# EasyEDA Pro project Keyboard.epro

# Schematic Schematic1
Board Name: Keyboard; Create Date: 2025-11-27; Page Name: KEYBOARD_MAIN; Project Name: esp32PhoneV2-retry; Schematic Name: Schematic1; Update Date: 2025-12-17; Company: EasyEDA.com; Page Size: A4; Version: V1.0
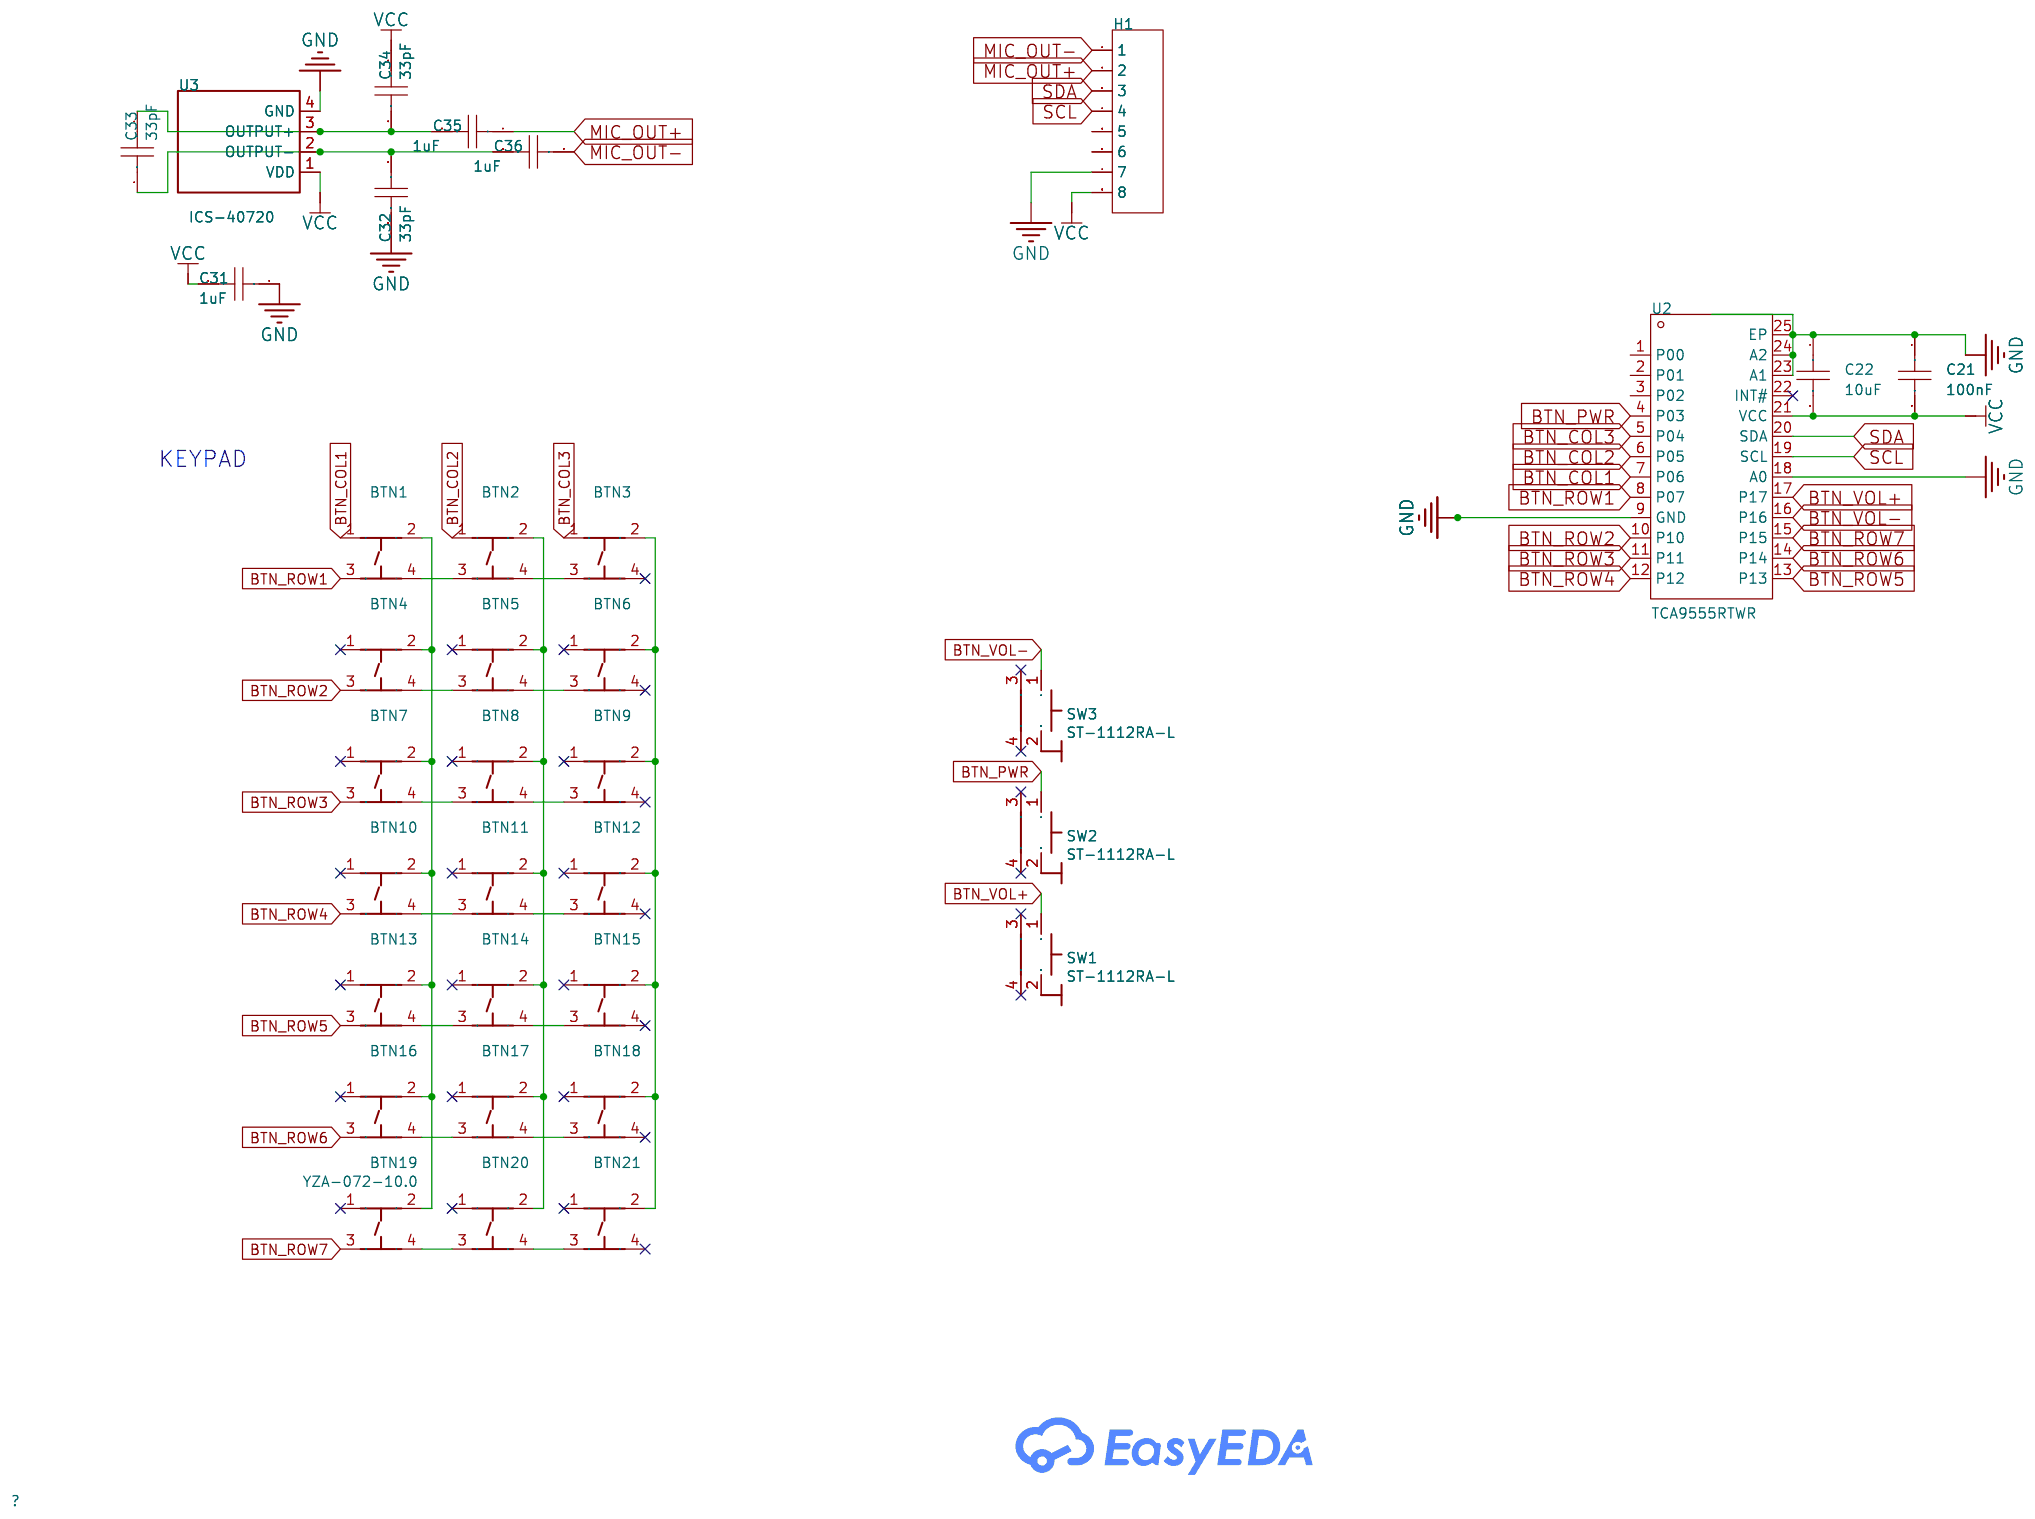
[diagram p0: schematic sheet]

## Parts
BTN1  YZA-072-10.0  [SW-SMD_4P-L6.0-W6.0-P4.5-LS9.0-YZA-072-10.0]
BTN2  YZA-072-10.0  [SW-SMD_4P-L6.0-W6.0-P4.5-LS9.0-YZA-072-10.0]
BTN3  YZA-072-10.0  [SW-SMD_4P-L6.0-W6.0-P4.5-LS9.0-YZA-072-10.0]
BTN4  YZA-072-10.0  [SW-SMD_4P-L6.0-W6.0-P4.5-LS9.0-YZA-072-10.0]
BTN5  YZA-072-10.0  [SW-SMD_4P-L6.0-W6.0-P4.5-LS9.0-YZA-072-10.0]
BTN6  YZA-072-10.0  [SW-SMD_4P-L6.0-W6.0-P4.5-LS9.0-YZA-072-10.0]
BTN7  YZA-072-10.0  [SW-SMD_4P-L6.0-W6.0-P4.5-LS9.0-YZA-072-10.0]
BTN8  YZA-072-10.0  [SW-SMD_4P-L6.0-W6.0-P4.5-LS9.0-YZA-072-10.0]
BTN9  YZA-072-10.0  [SW-SMD_4P-L6.0-W6.0-P4.5-LS9.0-YZA-072-10.0]
BTN10  YZA-072-10.0  [SW-SMD_4P-L6.0-W6.0-P4.5-LS9.0-YZA-072-10.0]
BTN11  YZA-072-10.0  [SW-SMD_4P-L6.0-W6.0-P4.5-LS9.0-YZA-072-10.0]
BTN12  YZA-072-10.0  [SW-SMD_4P-L6.0-W6.0-P4.5-LS9.0-YZA-072-10.0]
BTN13  YZA-072-10.0  [SW-SMD_4P-L6.0-W6.0-P4.5-LS9.0-YZA-072-10.0]
BTN14  YZA-072-10.0  [SW-SMD_4P-L6.0-W6.0-P4.5-LS9.0-YZA-072-10.0]
BTN15  YZA-072-10.0  [SW-SMD_4P-L6.0-W6.0-P4.5-LS9.0-YZA-072-10.0]
BTN16  YZA-072-10.0  [SW-SMD_4P-L6.0-W6.0-P4.5-LS9.0-YZA-072-10.0]
BTN17  YZA-072-10.0  [SW-SMD_4P-L6.0-W6.0-P4.5-LS9.0-YZA-072-10.0]
BTN18  YZA-072-10.0  [SW-SMD_4P-L6.0-W6.0-P4.5-LS9.0-YZA-072-10.0]
BTN19  YZA-072-10.0  [SW-SMD_4P-L6.0-W6.0-P4.5-LS9.0-YZA-072-10.0]
BTN20  YZA-072-10.0  [SW-SMD_4P-L6.0-W6.0-P4.5-LS9.0-YZA-072-10.0]
BTN21  YZA-072-10.0  [SW-SMD_4P-L6.0-W6.0-P4.5-LS9.0-YZA-072-10.0]
C21  100nF  [C0603]
C22  10uF  [C0603]
C31  1uF  [C0603]
C32  33pF  [C0603]
C33  33pF  [C0603]
C34  33pF  [C0603]
C35  1uF  [C0603]
C36  1uF  [C0603]
H1  -  [HDR-TH_8P-P2.54-V-M]
SW1  ST-1112RA-L  [SW-SMD_ST-1112RA-L]
SW2  ST-1112RA-L  [SW-SMD_ST-1112RA-L]
SW3  ST-1112RA-L  [SW-SMD_ST-1112RA-L]
U2  TCA9555RTWR  [VFQFPN-24_L4.0-W4.0-P0.50-BL-EP2.8]
U3  ICS-40720  [SMD_4P-P0.88_ICS-40720]

## Library data of the parts
BTN1-BTN21 = YZA-072-10.0: Supplier: LCSC; Supplier Part: C49108668; Manufacturer: YIZHI(逸致); JLCPCB Part Class: Extended Part; Contributor: lcsc; spicePre: U
C21 C22 C31-C36 = CAP_0603: Supplier Footprint: 0603
H1 = HDR-M_2.54_1x8P: Supplier Footprint: Through
SW1-SW3 = ST-1112RA-L: Supplier: LCSC; Supplier Part: C589179; Manufacturer: RISHENG(日昇); JLCPCB Part Class: Extended Part; Contributor: LCSC; spicePre: S
U2 = TCA9555RTWR: Interface:I2C；SMBus Number of I/O:16 Interrupt Output:With Interrupt Output Output Type: Supply Voltage:1.65V~5.5V Supply Voltage:1.65V~5.5V Output Source current:- Output Sink Current:- Clock Frequency:400kHz Operating Temperature:-40℃~+85℃ Operating Tem; LCSC Part Name: TCA9555 低电压16位 I²C 和 SMBus I/O 扩展器，带中断输出和配置寄存器; Supplier Part: C140277; Manufacturer: TI(德州仪器); Supplier Footprint: WQFN-24-EP(4x4); JLCPCB Part Class: Extended Part; Datasheet: https://www.ti.com/cn/lit/gpn/tca9555; Supplier: LCSC; Interface: I2C；SMBus; Number of I/O: 16; Interrupt Output: With Interrupt Output; Supply Voltage: 1.65V~5.5V; Clock Frequency: 400kHz; Operating Temperature: -40℃~+85℃
U3 = ICS-40720: Supplier: LCSC; Supplier Part: C3171779; Manufacturer: TDK InvenSense(应美盛); JLCPCB Part Class: Extended Part; Contributor: lcsc; spicePre: U

## Nets
GND: C21.1 C22.1 C31.1 C32.2 H1.7 U2.9(GND) U2.18(A0) U2.23(A1) U2.24(A2) U2.25(EP) U3.4(GND)
VCC: C21.2 C22.2 C31.2 C34.1 H1.8 SW1.2 SW2.2 SW3.2 U2.21(VCC) U3.1(VDD)
BTN_COL1: BTN1.1 U2.7(P06)
BTN_COL2: BTN2.1 U2.6(P05)
BTN_COL3: BTN3.1 U2.5(P04)
BTN_PWR: SW2.1 U2.4(P03)
BTN_ROW1: BTN1.3 U2.8(P07)
BTN_ROW2: BTN4.3 U2.10(P10)
BTN_ROW3: BTN7.3 U2.11(P11)
BTN_ROW4: BTN10.3 U2.12(P12)
BTN_ROW5: BTN13.3 U2.13(P13)
BTN_ROW6: BTN16.3 U2.14(P14)
BTN_ROW7: BTN19.3 U2.15(P15)
BTN_VOL+: SW1.1 U2.17(P17)
BTN_VOL-: SW3.1 U2.16(P16)
MIC_OUT+: C35.1 H1.2
MIC_OUT-: C36.1 H1.1
SCL: H1.4 U2.19(SCL)
SDA: H1.3 U2.20(SDA)
$1N1395: C33.1 C34.2 C35.2 U3.3(OUTPUT+)
$1N1401: C32.1 C33.2 C36.2 U3.2(OUTPUT−)
$1N4117: BTN1.2 BTN4.2 BTN7.2 BTN10.2 BTN13.2 BTN16.2 BTN19.2
$1N4118: BTN2.2 BTN5.2 BTN8.2 BTN11.2 BTN14.2 BTN17.2 BTN20.2
$1N4119: BTN3.2 BTN6.2 BTN9.2 BTN12.2 BTN15.2 BTN18.2 BTN21.2
$1N4120: BTN1.4 BTN2.3
$1N4121: BTN2.4 BTN3.3
$1N4122: BTN4.4 BTN5.3
$1N4123: BTN5.4 BTN6.3
$1N4124: BTN7.4 BTN8.3
$1N4125: BTN8.4 BTN9.3
$1N4126: BTN10.4 BTN11.3
$1N4127: BTN11.4 BTN12.3
$1N4128: BTN13.4 BTN14.3
$1N4129: BTN14.4 BTN15.3
$1N4130: BTN16.4 BTN17.3
$1N4131: BTN17.4 BTN18.3
$1N4132: BTN19.4 BTN20.3
$1N4133: BTN20.4 BTN21.3

Not connected (* = marked no-connect by the designer): BTN3 4*; BTN4 1*; BTN5 1*; BTN6 1* 4*; BTN7 1*; BTN8 1*; BTN9 1* 4*; BTN10 1*; BTN11 1*; BTN12 1* 4*; BTN13 1*; BTN14 1*; BTN15 1* 4*; BTN16 1*; BTN17 1*; BTN18 1* 4*; BTN19 1*; BTN20 1*; BTN21 1* 4*; H1 5 6; SW1 3* 4*; SW2 3* 4*; SW3 3* 4*; U2 1(P00) 2(P01) 3(P02) 22(INT#)*

## Notes on the sheet
- KEYPAD

# Board PCB3
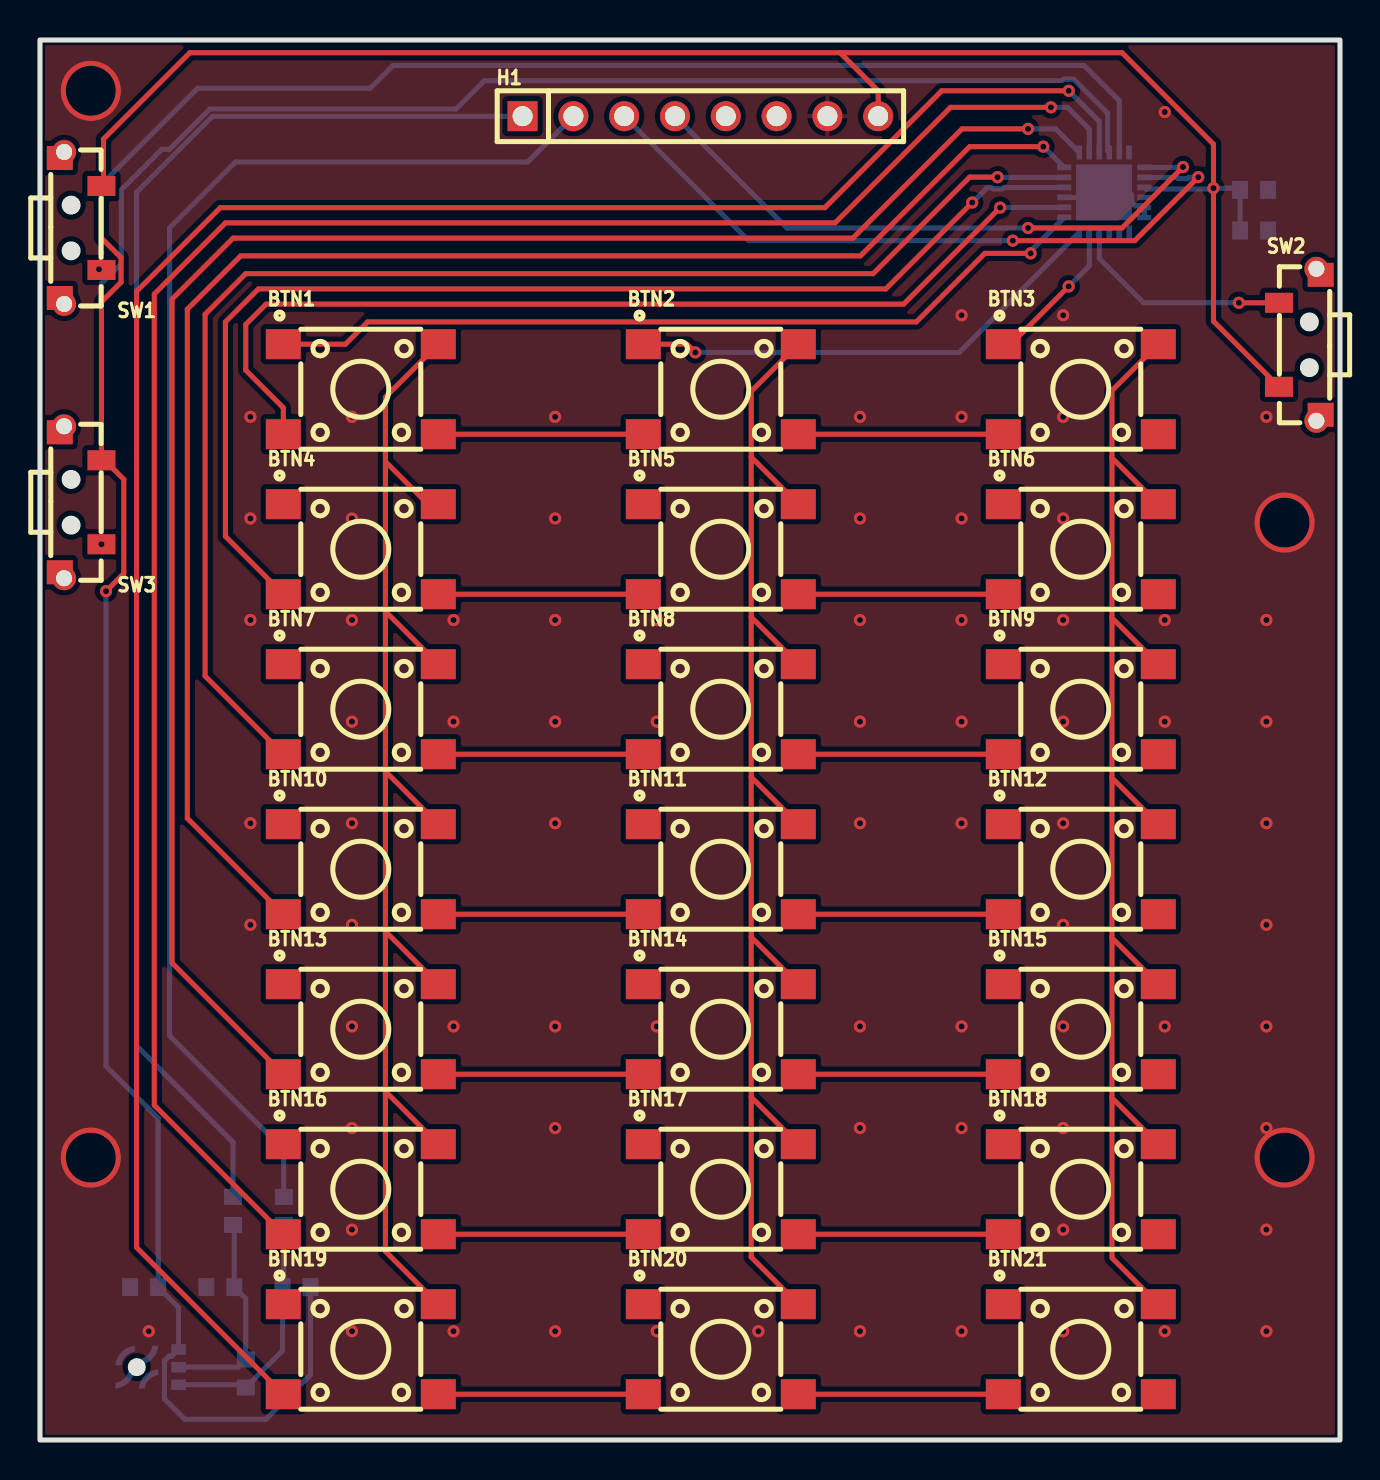
[diagram p1: board, top side]
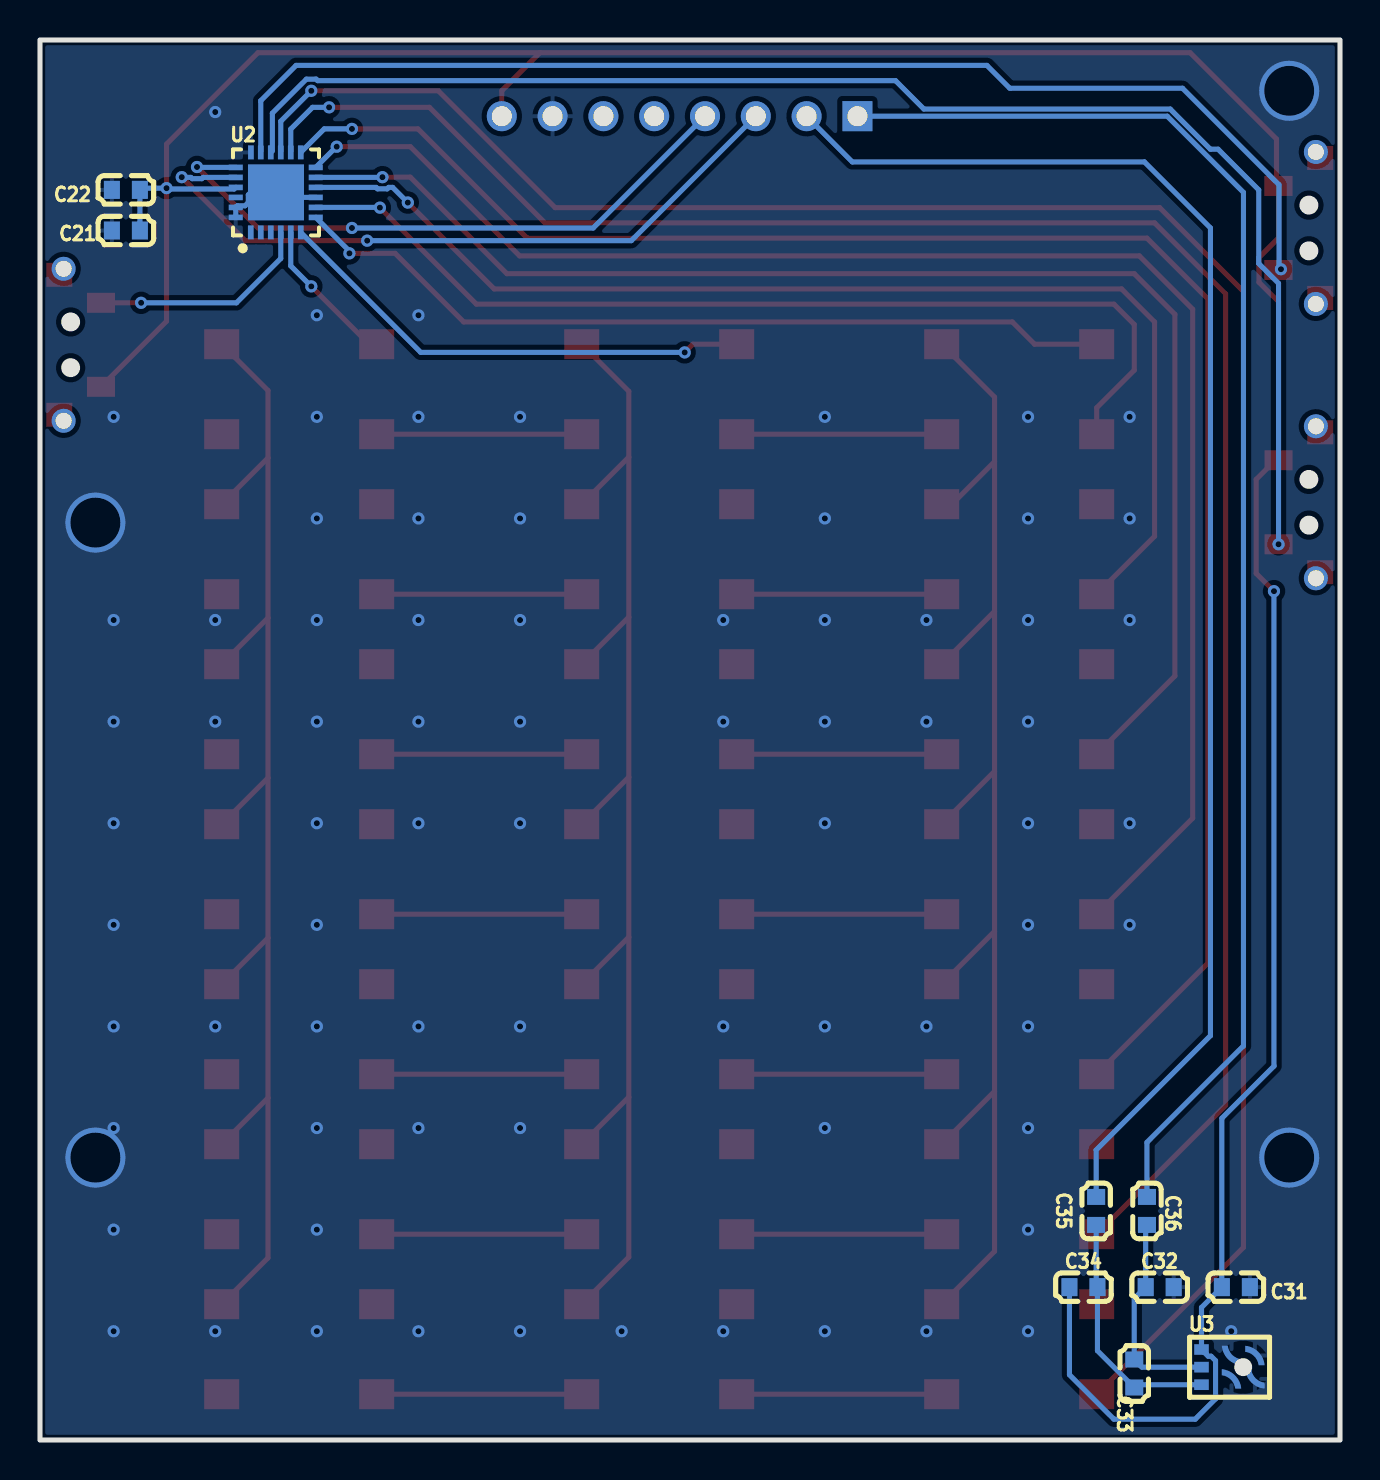
[diagram p2: board, bottom side, seen from below]

Outline 65 x 70 mm; copper layers: Top Layer, Bottom Layer. Coordinates in mm from the lower left corner of the outline.
Outline path: rectangle 0,70 65,0
Stack: Top Layer 0.035mm / Dielectric1 1.51mm FR4 er 4.5 / Bottom Layer 0.035mm

## Design rules (mm)
template: JLCPCB Capability(Two Layers Board)
spacing copperThickness1oz (default): track to track 0.102, other pairs 0.152 to 0.3
spacing copperThickness2oz: track to track 0.203, other pairs 0.152 to 0.3
track width copperThickness1oz (default): min 0.127, default 0.254, max 2.54
track width copperThickness2oz: min 0.203, default 0.254, max 2.54
differential pair differentialPair (default): width min 0.127, default 0.254, max 2.54; gap min 0.152, default 0.152
via viaSize (default): diameter min 0.5, default 0.61, max 10; hole min 0.3, default 0.305, max 6.3

## Placement (name value [footprint] x y rotation side)
BTN1  YZA-072-10.0  [SW-SMD_4P-L6.0-W6.0-P4.5-LS9.0-YZA-072-10.0]  16.04 52.54 0 top
BTN2  YZA-072-10.0  [SW-SMD_4P-L6.0-W6.0-P4.5-LS9.0-YZA-072-10.0]  34.04 52.54 0 top
BTN3  YZA-072-10.0  [SW-SMD_4P-L6.0-W6.0-P4.5-LS9.0-YZA-072-10.0]  52.04 52.54 0 top
BTN4  YZA-072-10.0  [SW-SMD_4P-L6.0-W6.0-P4.5-LS9.0-YZA-072-10.0]  16.04 44.54 0 top
BTN5  YZA-072-10.0  [SW-SMD_4P-L6.0-W6.0-P4.5-LS9.0-YZA-072-10.0]  34.04 44.54 0 top
BTN6  YZA-072-10.0  [SW-SMD_4P-L6.0-W6.0-P4.5-LS9.0-YZA-072-10.0]  52.04 44.54 0 top
BTN7  YZA-072-10.0  [SW-SMD_4P-L6.0-W6.0-P4.5-LS9.0-YZA-072-10.0]  16.04 36.54 0 top
BTN8  YZA-072-10.0  [SW-SMD_4P-L6.0-W6.0-P4.5-LS9.0-YZA-072-10.0]  34.04 36.54 0 top
BTN9  YZA-072-10.0  [SW-SMD_4P-L6.0-W6.0-P4.5-LS9.0-YZA-072-10.0]  52.04 36.54 0 top
BTN10  YZA-072-10.0  [SW-SMD_4P-L6.0-W6.0-P4.5-LS9.0-YZA-072-10.0]  16.04 28.54 0 top
BTN11  YZA-072-10.0  [SW-SMD_4P-L6.0-W6.0-P4.5-LS9.0-YZA-072-10.0]  34.04 28.54 0 top
BTN12  YZA-072-10.0  [SW-SMD_4P-L6.0-W6.0-P4.5-LS9.0-YZA-072-10.0]  52.04 28.54 0 top
BTN13  YZA-072-10.0  [SW-SMD_4P-L6.0-W6.0-P4.5-LS9.0-YZA-072-10.0]  16.04 20.54 0 top
BTN14  YZA-072-10.0  [SW-SMD_4P-L6.0-W6.0-P4.5-LS9.0-YZA-072-10.0]  34.04 20.54 0 top
BTN15  YZA-072-10.0  [SW-SMD_4P-L6.0-W6.0-P4.5-LS9.0-YZA-072-10.0]  52.04 20.54 0 top
BTN16  YZA-072-10.0  [SW-SMD_4P-L6.0-W6.0-P4.5-LS9.0-YZA-072-10.0]  16.04 12.54 0 top
BTN17  YZA-072-10.0  [SW-SMD_4P-L6.0-W6.0-P4.5-LS9.0-YZA-072-10.0]  34.04 12.54 0 top
BTN18  YZA-072-10.0  [SW-SMD_4P-L6.0-W6.0-P4.5-LS9.0-YZA-072-10.0]  52.04 12.54 0 top
BTN19  YZA-072-10.0  [SW-SMD_4P-L6.0-W6.0-P4.5-LS9.0-YZA-072-10.0]  16.04 4.54 0 top
BTN20  YZA-072-10.0  [SW-SMD_4P-L6.0-W6.0-P4.5-LS9.0-YZA-072-10.0]  34.04 4.54 0 top
BTN21  YZA-072-10.0  [SW-SMD_4P-L6.0-W6.0-P4.5-LS9.0-YZA-072-10.0]  52.04 4.54 0 top
C21  100nF  [C0603]  60.71 60.47 180 bottom
C22  10uF  [C0603]  60.71 62.51 180 bottom
C31  1uF  [C0603]  5.21 7.64 0 bottom
C32  33pF  [C0603]  9.02 7.64 180 bottom
C33  33pF  [C0603]  10.29 3.32 90 bottom
C34  33pF  [C0603]  12.83 7.64 180 bottom
C35  1uF  [C0603]  12.19 11.45 270 bottom
C36  1uF  [C0603]  9.65 11.45 270 bottom
H1  PZ254V-11-08P  [HDR-TH_8P-P2.54-V-M]  33.02 66.19 0 top
SW1  ST-1112RA-L  [SW-SMD_ST-1112RA-L]  2.03 60.6 180 top
SW2  ST-1112RA-L  [SW-SMD_ST-1112RA-L]  62.99 54.76 0 top
SW3  ST-1112RA-L  [SW-SMD_ST-1112RA-L]  2.03 46.89 180 top
U2  TCA9555RTWR  [VFQFPN-24_L4.0-W4.0-P0.50-BL-EP2.8]  53.21 62.38 180 bottom
U3  ICS-40720  [SMD_4P-P0.88_ICS-40720]  5.59 3.64 180 bottom

## Footprints (pads in the part's own frame, mm; a bottom-side part is the same pattern mirrored in y, then rotated)
C0603
  rect 0.8x0.9 smd: 1(-0.7,0) 2(0.7,0)
HDR-TH_8P-P2.54-V-M
  rect 1.5x1.5 hole 1: 1(-8.89,0)
  round 1.5 hole 1: 2(-6.35,0) 3(-3.81,0) 4(-1.27,0) 5(1.27,0) 6(3.81,0) 7(6.35,0) 8(8.89,0)
SMD_4P-P0.88_ICS-40720
  rect 0.73x0.53 smd: 1(-1.335,0.88) 2(-1.335,0) 3(-1.335,-0.88)
  custom 0.97x0.97 smd: 4(0.165,-0.59) 4(0.165,0.58) 4(1.335,-0.59) 4(1.335,0.58)
SW-SMD_4P-L6.0-W6.0-P4.5-LS9.0-YZA-072-10.0
  rect 1.75x1.5 smd: 1(-3.875,2.25) 2(3.875,2.25) 3(-3.875,-2.25) 4(3.875,-2.25)
SW-SMD_ST-1112RA-L
  rect 1.4x1 smd: 1(-1.041,2.1) 2(-1.041,-2.1)
  round 1.2 hole 0.8: 3(0.827,3.8) 4(0.827,-3.8)
  rect 1.3x1.2 smd: 3(1.041,3.5) 4(1.041,-3.5)
VFQFPN-24_L4.0-W4.0-P0.50-BL-EP2.8
  rect 0.28x0.7 smd: 1(-1.25,-2) 2(-0.75,-2) 3(-0.25,-2) 4(0.25,-2) 5(0.75,-2) 6(1.25,-2) 13(1.25,2) 14(0.75,2) 15(0.25,2) 16(-0.25,2) 17(-0.75,2) 18(-1.242,2)
  rect 0.7x0.28 smd: 7(2,-1.25) 8(2,-0.75) 9(2,-0.25) 10(2,0.25) 11(2,0.75) 12(2,1.25) 19(-2,1.25) 20(-2,0.75) 21(-2,0.25) 22(-2,-0.25) 23(-2,-0.75) 24(-2,-1.25)
  rect 2.8x2.8 smd: 25(0.013,0)

## Nets
As in the schematic.

Pads without a net: BTN3 4; BTN4 1; BTN5 1; BTN6 1 4; BTN7 1; BTN8 1; BTN9 1 4; BTN10 1; BTN11 1; BTN12 1 4; BTN13 1; BTN14 1; BTN15 1 4; BTN16 1; BTN17 1; BTN18 1 4; BTN19 1; BTN20 1; BTN21 1 4; H1 5 6; SW1 3 4; SW2 3 4; SW3 3 4; U2 1 2 3 22

## Via types
v1: diameter 0.61, hole 0.305, Top Layer to Bottom Layer, 94 vias
v2: diameter 3, hole 2.5, Top Layer to Bottom Layer, 4 vias

## Routing (per net, layer and track width the routed paths; a pad name or vN(x,y) marks a point on that pad's centre or on a via; arc(x,y) is an arc through that point)
GND: length 5.1
  Bottom Layer w0.254: U2.9 52.95,62.13 U2.25 54.46,62.38 54.58,62.26 54.58,61.87 54.75,61.71 55.13,61.71 U2.23 U2.24
  vias: v1(5.44,5.44) v1(10.52,51.16) v1(10.52,46.08) v1(10.52,41) v1(10.52,30.84) v1(10.52,25.76) v1(15.6,51.16) v1(15.6,46.08) v1(15.6,41) v1(15.6,35.92) v1(15.6,30.84) v1(15.6,25.76) v1(15.6,20.68) v1(15.6,15.6) v1(15.6,10.52) v1(15.6,5.44) v1(20.68,41) v1(20.68,35.92) v1(20.68,20.68) v1(20.68,5.44) v1(25.76,51.16) v1(25.76,46.08) v1(25.76,41) v1(25.76,35.92) v1(25.76,30.84) v1(25.76,20.68) v1(25.76,15.6) v1(25.76,5.44) v1(30.84,41) v1(30.84,35.92) v1(30.84,20.68) v1(30.84,5.44) v1(35.92,5.44) v1(41,51.16) v1(41,46.08) v1(41,41) v1(41,35.92) v1(41,30.84) v1(41,20.68) v1(41,15.6) v1(41,5.44) v1(46.08,56.24) v1(46.08,51.16) v1(46.08,46.08) v1(46.08,41) v1(46.08,35.92) v1(46.08,30.84) v1(46.08,20.68) v1(46.08,15.6) v1(46.08,5.44) v1(51.16,56.24) v1(51.16,51.16) v1(51.16,46.08) v1(51.16,41) v1(51.16,35.92) v1(51.16,30.84) v1(51.16,25.76) v1(51.16,20.68) v1(51.16,15.6) v1(51.16,10.52) v1(51.16,5.44) v1(56.24,66.4) v1(56.24,41) v1(56.24,35.92) v1(56.24,20.68) v1(56.24,5.44) v1(61.32,51.16) v1(61.32,41) v1(61.32,35.92) v1(61.32,30.84) v1(61.32,25.76) v1(61.32,20.68) v1(61.32,15.6) v1(61.32,10.52) v1(61.32,5.44) v2(2.54,67.46) v2(2.54,14.12) v2(62.23,45.87) v2(62.23,14.12)
VCC: length 163.5
  Top Layer w0.254: v1(3.3,42.44) 4.19,43.33 4.19,48.03 3.23,48.99 SW3.2 3.07,56.91 4.05,57.89 4.05,59.12 3.07,60.1 3.07,62.45 ; H1.8 41.91,67.46 40,69.36 ; 3.07,62.45 3.17,62.55 3.17,65.05 7.49,69.36 40,69.36 ; 3.07,62.45 SW1.2 ; 40,69.36 54.1,69.36 58.67,64.79 v1(58.67,62.59) 58.67,55.94 SW2.2
  Bottom Layer w0.254: v1(3.3,42.44) 3.3,18.69 5.91,16.09 C31.2 6.92,6.62 U3.1 6.59,4.19 6.44,4.19 6.22,3.97 6.22,2.06 7.24,1.04 11.3,1.04 13.53,3.26 C34.1 ; v1(58.67,62.59) 59.92,62.59 C22.2 C21.2 ; U2.21 55.29,62.55 58.59,62.55 58.67,62.63
BTN_COL1: length 41.7
  Top Layer w0.254: BTN1.1 15.27,54.79 16.38,55.9 43.81,55.9 47.24,59.33 v1(49.53,59.33)
  Bottom Layer w0.254: v1(49.53,59.33) 49.53,59.45 U2.7
BTN_COL2: length 24.5
  Top Layer w0.254: v1(32.77,54.38) 32.36,54.79 BTN2.1
  Bottom Layer w0.254: v1(32.77,54.38) 45.96,54.38 U2.6
BTN_COL3: length 7.6
  Top Layer w0.254: BTN3.1 48.54,54.79 v1(51.44,57.68)
  Bottom Layer w0.254: U2.5 52.46,58.71 v1(51.44,57.68)
BTN_PWR: length 11.2
  Top Layer w0.254: SW2.1 v1(59.94,56.86)
  Bottom Layer w0.254: U2.4 52.96,59.07 55.18,56.86 v1(59.94,56.86)
BTN_ROW1: length 49.6
  Top Layer w0.254: 12.17,50.29 12.17,51.61 10.29,53.49 10.29,55.78 11.3,56.79 43.18,56.79 v1(48.01,61.62)
  Bottom Layer w0.254: U2.8 48.02,61.63 v1(48.01,61.62)
BTN_ROW2: length 59.6
  Top Layer w0.254: v1(46.61,61.87) 42.29,57.55 10.92,57.55 9.27,55.9 9.27,45.18 12.17,42.29
  Bottom Layer w0.254: U2.10 48.19,62.63 48.12,62.56 47.64,62.56 47.56,62.63 47.37,62.63 v1(46.61,61.87)
BTN_ROW3: length 69.4
  Top Layer w0.254: 12.17,34.29 8.25,38.2 8.25,56.28 10.29,58.32 41.66,58.32 46.48,63.14 v1(47.88,63.14)
  Bottom Layer w0.254: v1(47.88,63.14) 47.89,63.13 U2.11
BTN_ROW4: length 79.9
  Top Layer w0.254: 12.17,26.29 7.37,31.09 7.37,56.54 10.03,59.2 41.02,59.2 46.48,64.67 v1(50.16,64.67)
  Bottom Layer w0.254: v1(50.16,64.67) 50.18,64.67 U2.12
BTN_ROW5: length 90.4
  Top Layer w0.254: v1(49.4,65.56) 46.1,65.56 40.64,60.09 9.65,60.09 6.6,57.05 6.6,23.85 12.17,18.29
  Bottom Layer w0.254: v1(49.4,65.56) 50.79,65.56 U2.13
BTN_ROW6: length 101.9
  Top Layer w0.254: v1(50.55,66.63) 45.53,66.63 39.75,60.86 9.27,60.86 5.72,57.3 5.72,16.74 12.17,10.29
  Bottom Layer w0.254: U2.14 52.46,65.54 51.37,66.63 v1(50.55,66.63)
BTN_ROW7: length 112.7
  Top Layer w0.254: v1(51.44,67.46) 45.09,67.46 39.24,61.62 9.02,61.62 4.83,57.43 4.83,9.63 12.17,2.29
  Bottom Layer w0.254: v1(51.44,67.46) 52.96,65.93 U2.15
BTN_VOL+: length 61
  Bottom Layer w0.254: v1(2.95,58.54) 3.05,58.63 3.05,62.76 7.87,67.59 16.51,67.59 17.65,68.73 52.2,68.73 53.96,66.96 U2.17
BTN_VOL-: length 72.4
  Bottom Layer w0.254: U2.16 53.38,64.46 53.38,66.34 51.68,68.04 51.19,68.04 51.12,67.97 22.22,67.97 20.8,66.55 8.49,66.55 6.48,64.54 6.1,64.54 4.06,62.51 4.06,58.82 3.07,57.83 v1(3.07,44.79)
MIC_OUT+: length 73.3
  Bottom Layer w0.254: H1.2 24.38,63.9 9.78,63.9 6.48,60.6 6.48,20.22 12.19,14.5 C35.1
MIC_OUT-: length 73.1
  Bottom Layer w0.254: C36.1 9.65,14.88 4.83,19.71 4.83,62.38 8.64,66.19 H1.1
SCL: length 30.9
  Top Layer w0.254: v1(57.15,63.65) 54.1,60.6 v1(49.4,60.6)
  Bottom Layer w0.254: v1(49.4,60.6) 37.34,60.6 H1.4 ; U2.19 57.13,63.63 v1(57.15,63.65)
SDA: length 35.4
  Top Layer w0.254: v1(57.91,63.14) 54.74,59.97 v1(48.64,59.97)
  Bottom Layer w0.254: v1(48.64,59.97) 35.43,59.97 H1.3 ; U2.20 56.84,63.13 56.91,63.07 57.39,63.07 57.46,63.13 57.9,63.13 v1(57.91,63.14)
$1N1395: length 12.3
  Bottom Layer w0.254: 12.19,10.75 12.19,7.71 C34.2 12.13,4.47 C33.1 10.15,2.76 U3.3
$1N1401: length 10.5
  Bottom Layer w0.254: 9.65,10.75 9.72,10.69 9.72,7.64 10.29,7.07 C33.2 9.91,3.64 U3.2
$1N4117: length 68.7
  Top Layer w0.254: BTN4.2 19.4,46.79 17.27,48.92 ; 17.27,48.92 17.27,52.15 BTN1.2 ; 17.27,48.92 17.27,41.43 ; 17.27,25.43 17.27,17.43 ; 17.27,25.43 BTN13.2 ; 17.27,25.43 17.27,33.43 ; 17.27,17.43 17.27,9.43 BTN19.2 ; 17.27,17.43 BTN16.2 ; 17.27,41.43 17.27,33.43 ; 17.27,41.43 BTN7.2 ; 17.27,33.43 BTN10.2
$1N4118: length 66.6
  Top Layer w0.254: 35.56,33.14 BTN11.2 ; 35.56,33.14 35.56,25.14 ; 35.56,33.14 35.56,41.14 ; 35.56,25.14 BTN14.2 ; 35.56,25.14 35.56,17.14 ; 35.56,49.14 BTN5.2 ; 35.56,49.14 35.56,52.43 BTN2.2 ; 35.56,49.14 35.56,41.14 ; 35.56,17.14 35.56,9.14 BTN20.2 ; 35.56,17.14 BTN17.2 ; 35.56,41.14 BTN8.2
$1N4119: length 66.3
  Top Layer w0.254: 53.6,17.1 53.6,25.1 ; 53.6,17.1 53.6,9.1 BTN21.2 ; 53.6,17.1 BTN18.2 ; 53.6,25.1 53.6,33.1 ; 53.6,25.1 BTN15.2 ; BTN3.2 53.6,52.47 53.6,49.1 ; BTN9.2 53.6,41.1 ; 53.6,41.1 53.6,49.1 ; 53.6,41.1 53.6,33.1 ; 53.6,49.1 BTN6.2 ; 53.6,33.1 BTN12.2
$1N4120: length 10.2
  Top Layer w0.254: 19.92,50.29 30.17,50.29
$1N4121: length 10.2
  Top Layer w0.254: 37.92,50.29 48.17,50.29
$1N4122: length 10.2
  Top Layer w0.254: 19.92,42.29 30.17,42.29
$1N4123: length 10.2
  Top Layer w0.254: 37.92,42.29 48.17,42.29
$1N4124: length 10.2
  Top Layer w0.254: 19.92,34.29 30.17,34.29
$1N4125: length 10.2
  Top Layer w0.254: 37.92,34.29 48.17,34.29
$1N4126: length 10.2
  Top Layer w0.254: 19.92,26.29 30.17,26.29
$1N4127: length 10.2
  Top Layer w0.254: 37.92,26.29 48.17,26.29
$1N4128: length 10.2
  Top Layer w0.254: 19.92,18.29 30.17,18.29
$1N4129: length 10.2
  Top Layer w0.254: 37.92,18.29 48.17,18.29
$1N4130: length 10.2
  Top Layer w0.254: 19.92,10.29 30.17,10.29
$1N4131: length 10.2
  Top Layer w0.254: 37.92,10.29 48.17,10.29
$1N4132: length 10.2
  Top Layer w0.254: 19.92,2.29 30.17,2.29
$1N4133: length 10.2
  Top Layer w0.254: 37.92,2.29 48.17,2.29

## Copper pours and planes (outline as drawn; the poured copper is in the pictures)
GND on Top Layer: 0,70 65,70 65,0 0,0
GND on Bottom Layer: 0,70 65,70 65,0 0,0
